# EAGLE design ai_icsp_connector (EAGLE 7.2.0)
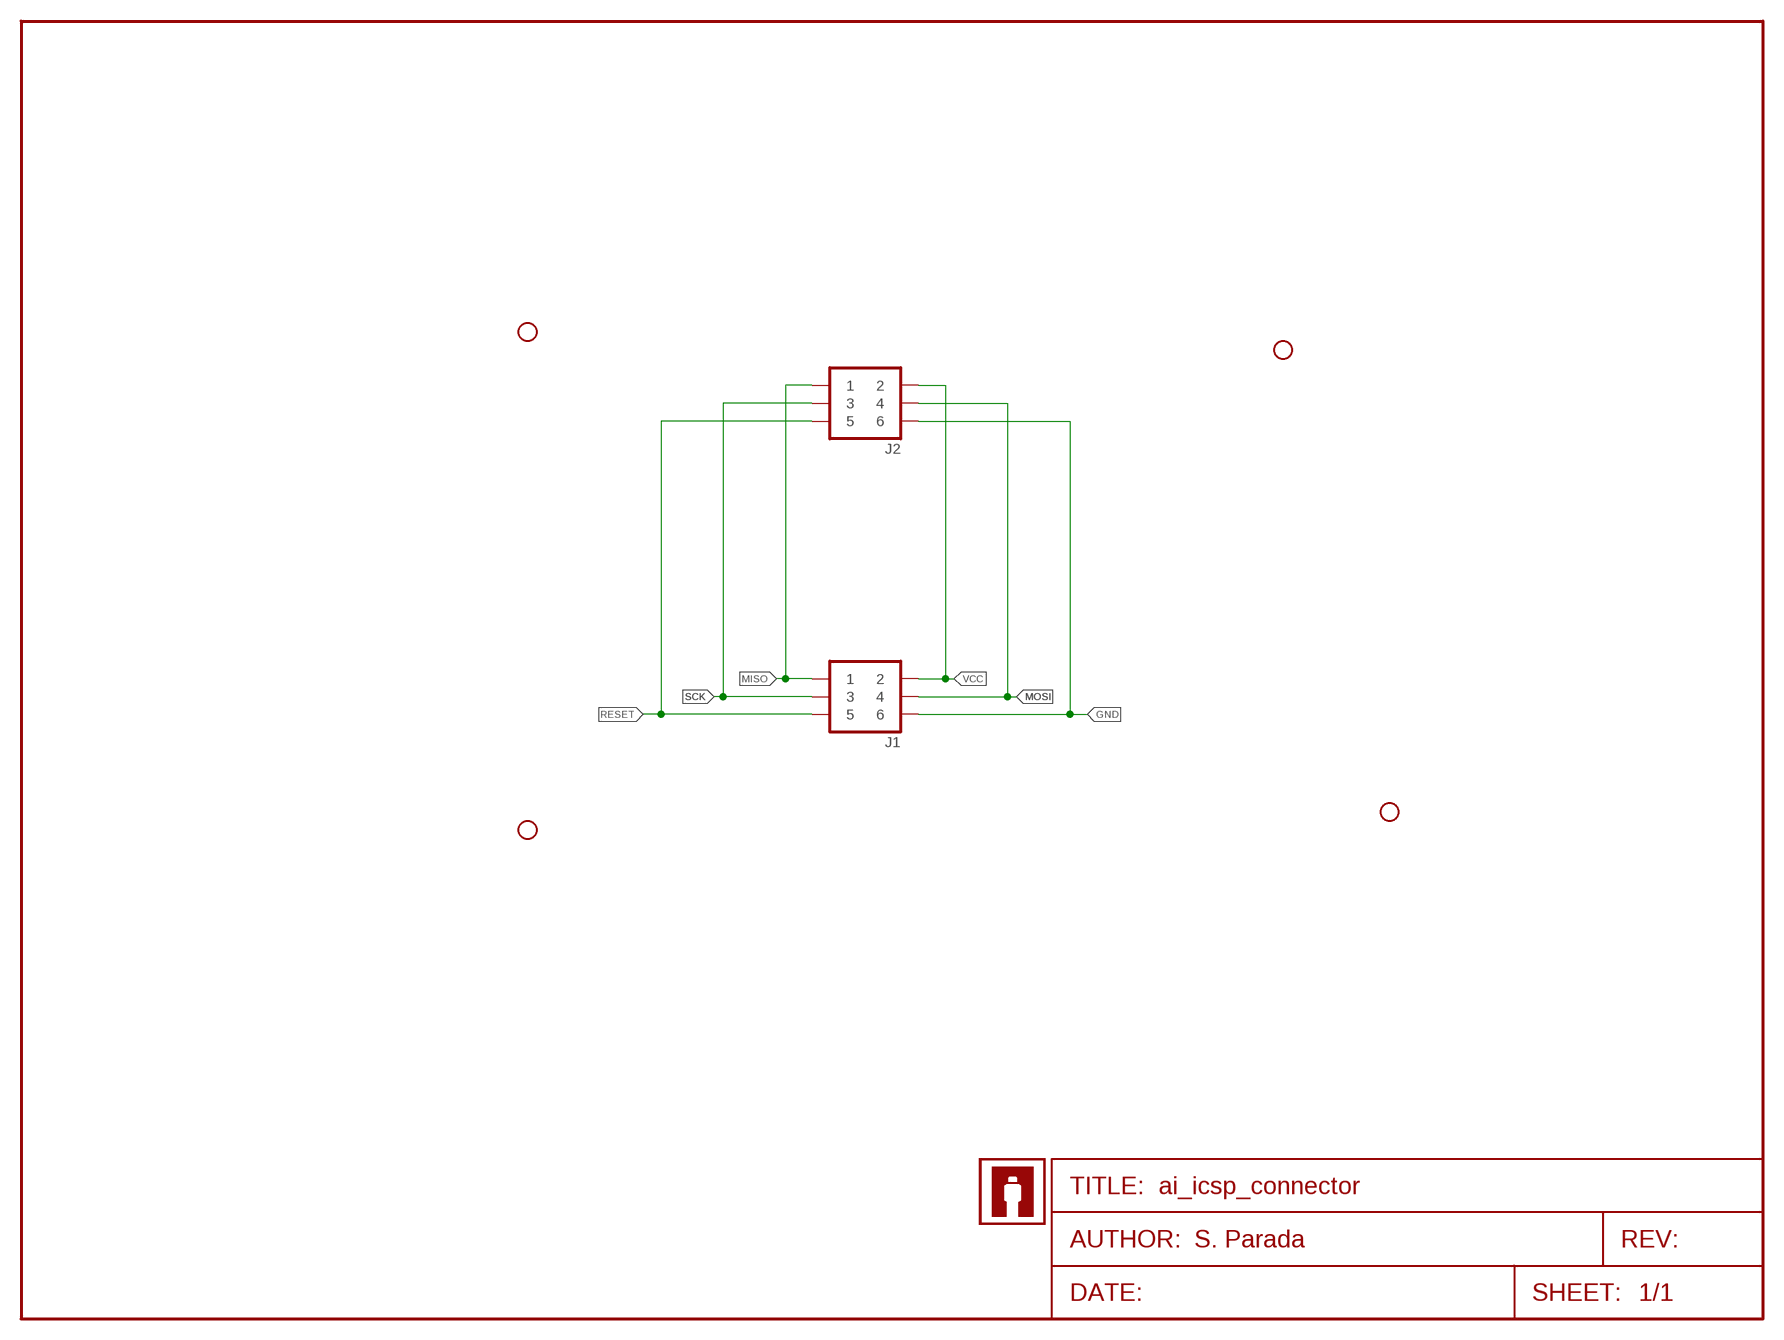
[diagram p0: schematic, sheet 1]
FRAME1 (FRAME-LETTER): AUTHOR: S. Parada

## Parts
J1  2X03  [2X03]
J2  2X032X03-ICSP  [2X03-ICSP]
STANDOFF1  STAND-OFF4  [STAND-OFF-4]
STANDOFF2  STAND-OFF4  [STAND-OFF-4]
STANDOFF3  STAND-OFF4  [STAND-OFF-4]
STANDOFF4  STAND-OFF4  [STAND-OFF-4]
U$1  AI-LOGOXS  [AI-LOGO-XS]

## Nets
GND: J1.6 J2.6
MISO: J1.1 J2.1
MOSI: J1.4 J2.4
RESET: J1.5 J2.5
SCK: J1.3 J2.3
VCC: J1.2 J2.2

## Library data of the parts
J1 J2 = Ai_Connectors:2X03
STANDOFF1-STANDOFF4 = Ai_Electromechanical:STAND-OFF: Size #4
U$1 = Ai_Miscellany:AI-LOGO

## Board
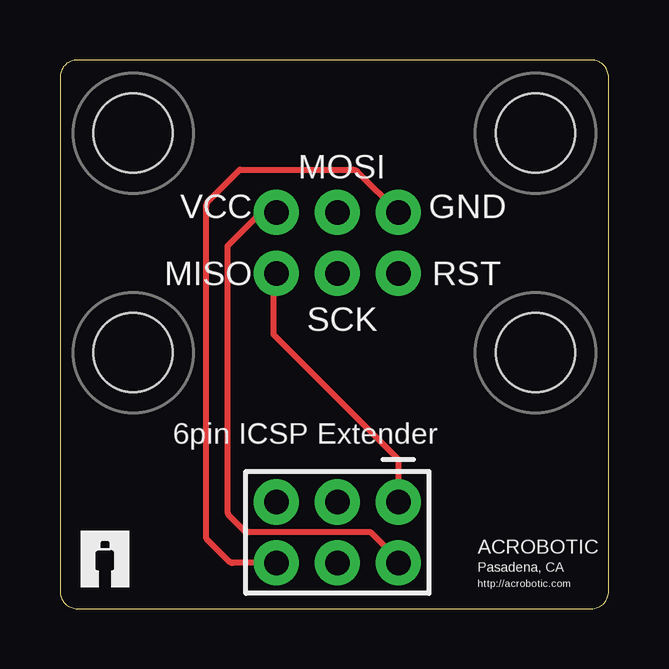
[diagram p1: board, top side]
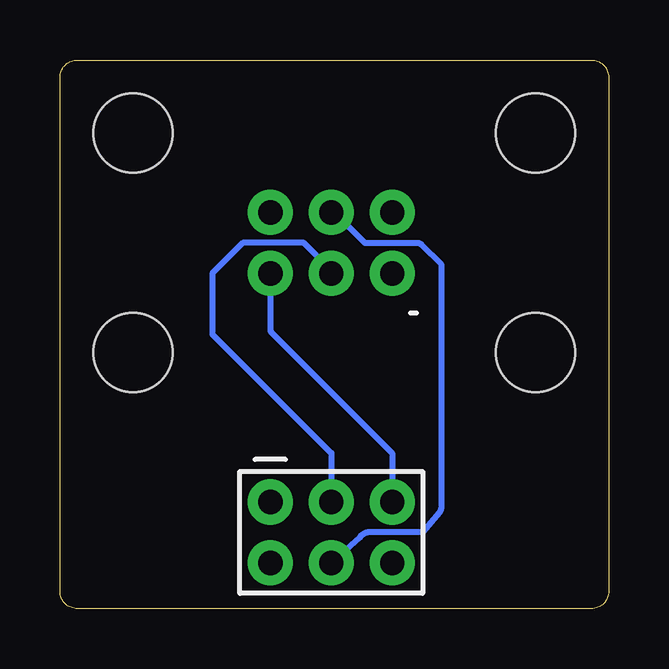
[diagram p2: board, bottom side, seen from below]

Size 22.86 x 22.86 mm. Coordinates in mm from the lower left corner, seen from the top.
Outline: 0,22.14 0,0.72 arc90 0.72,0 22.14,0 arc90 22.86,0.72 22.86,22.14 arc90 22.14,22.86 0.72,22.86 arc90 0,22.14
Copper layers (1*16): Top 0.035mm / dielectric 1.5mm / Bottom 0.035mm
Design rules "ai_2layer": minimum track width 7mil, minimum drill 15mil, track to track 8mil, track to pad 8mil, pad to pad 8mil, via to via 8mil, smd to smd 8mil, copper to edge 8mil, drill to drill 8mil, minimum pad ring 12mil, minimum via ring 10mil, stop-mask expansion 4mil, vias tented up to drill 20mil, thermal gap 10mil

### Footprints (pad centres in the part's own frame; a part is rotated, then mirrored left to right if it is on the bottom)
2X03 = drill 1.016 pad 1.88: 1 -2.54,-1.27; 2 -2.54,1.27; 3 0,-1.27; 4 0,1.27; 5 2.54,-1.27; 6 2.54,1.27
2X03-ICSP = drill 1.016 pad 1.88: 1 -2.54,-1.27; 2 -2.54,1.27; 3 0,-1.27; 4 0,1.27; 5 2.54,-1.27; 6 2.54,1.27
STAND-OFF-4 = hole 3.302: 0,0

### Placement (x,y rotation side)
J1  11.56,3.17 180 top
J2  11.56,15.24 0 top
STANDOFF1  3.05,19.81 0 top
STANDOFF2  19.81,19.81 0 top
STANDOFF3  3.05,10.67 0 top
STANDOFF4  19.81,10.67 0 top
U$1  0.89,0.89 0 top

### Tracks (layer width: path | path; a pad name or v marks a point on that pad's centre or on a via)
GND
  Top 0.254: J1.6 7.22,1.91 arc-45 7.04,1.98 6.1,2.92 6.1,16.79 arc-45 6.17,16.96 7.49,18.29 12.21,18.29 arc-45 12.39,18.21 J2.6
MISO
  Top 0.254: J2.1 8.96,13.92 arc45 8.89,13.74 8.89,11.43 14.02,6.3 arc-45 14.1,6.12 J1.1
MOSI
  Bottom 0.254: J2.4 11.54,16.51 arc45 11.36,16.44 10.16,15.24 7.98,15.24 arc45 7.8,15.17 6.99,14.35 6.99,4.17 arc45 7.06,3.99 7.75,3.17 10.05,3.17 arc-45 10.36,2.97 J1.4
RESET
  Bottom 0.254: J2.5 14.1,11.66 arc-45 14.02,11.48 9.02,6.48 J1.5
SCK
  Bottom 0.254: J2.3 11.56,13.99 arc-45 11.63,14.17 12.7,15.24 15.24,15.24 16.51,13.97 16.51,11.43 11.56,6.48 J1.3
VCC
  Top 0.254: J1.2 14.1,1.93 arc45 14.02,2.11 12.95,3.17 7.75,3.17 7.06,3.86 arc-45 6.99,4.04 6.99,15.11 8.31,16.44 arc-45 8.49,16.51 J2.2

### Text on the board
tPlace: 6pin ICSP Extender | ACROBOTIC | Pasadena, CA | http://acrobotic.com
tNames: MOSI | VCC | GND | MISO | RST | SCK